# Altium project Health Bracelet.PrjPcb
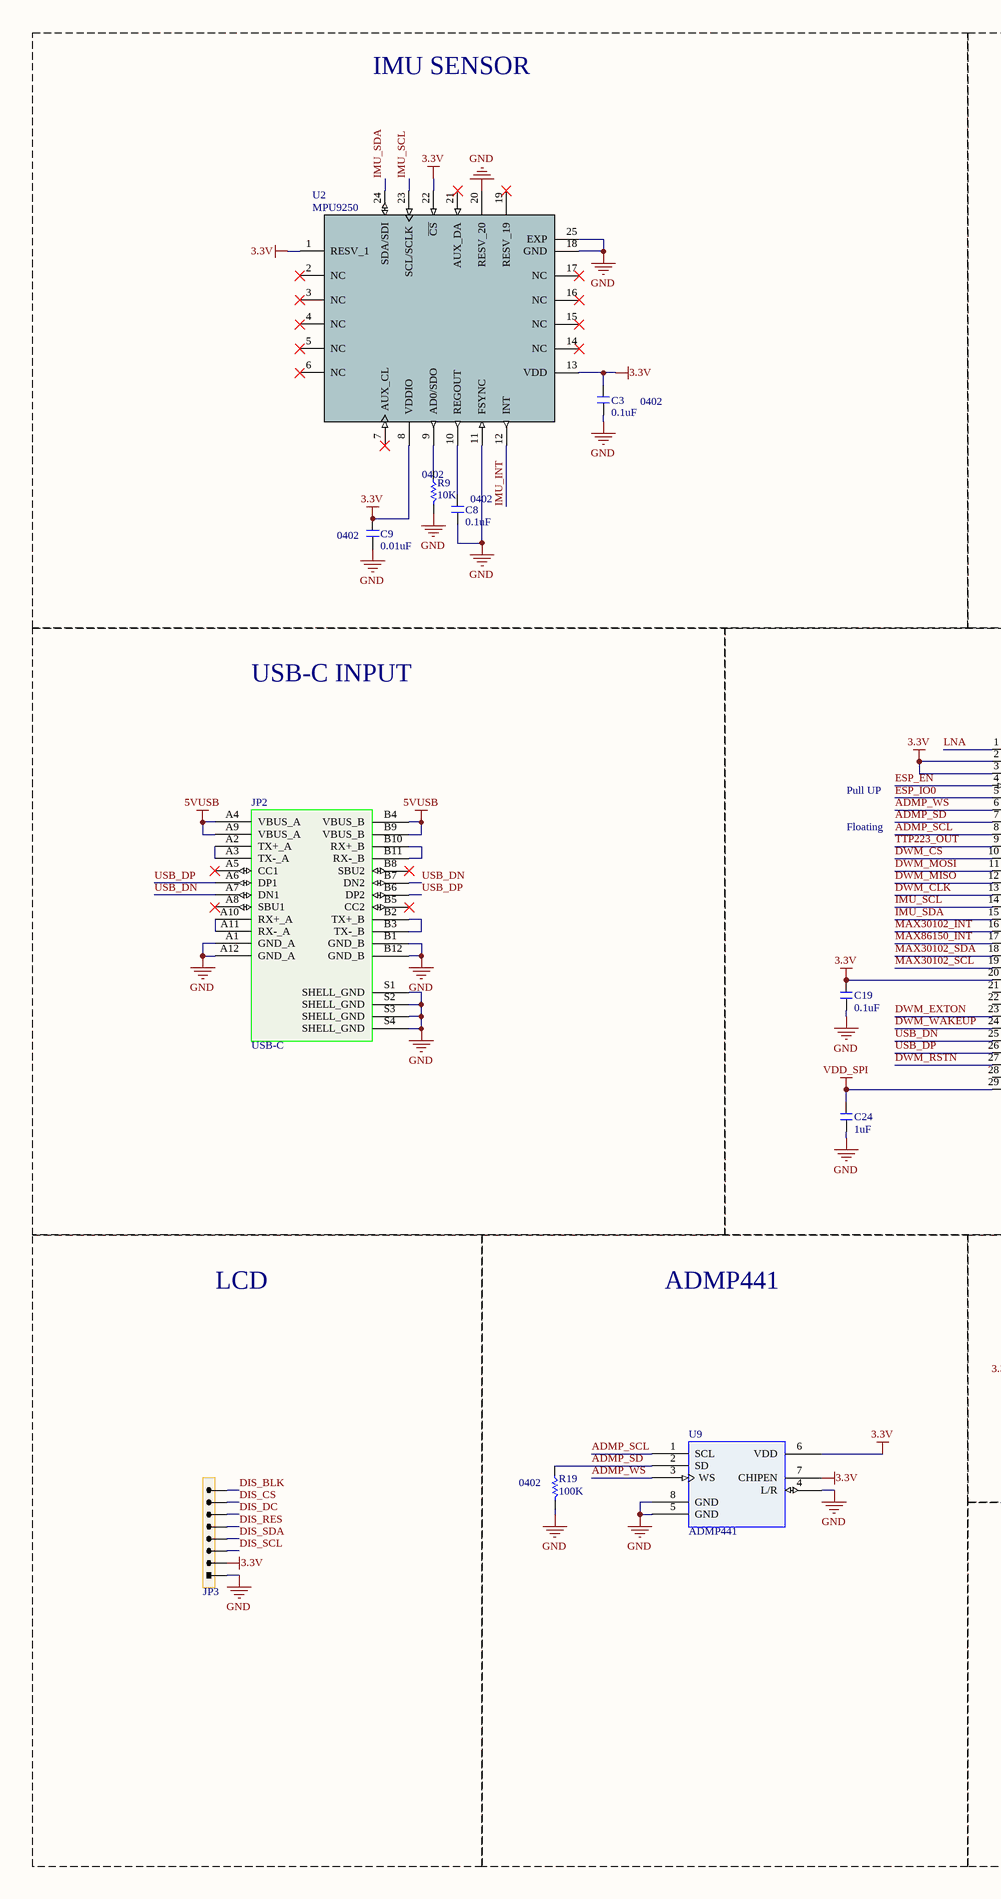
[diagram p0: Main.SchDoc, left]
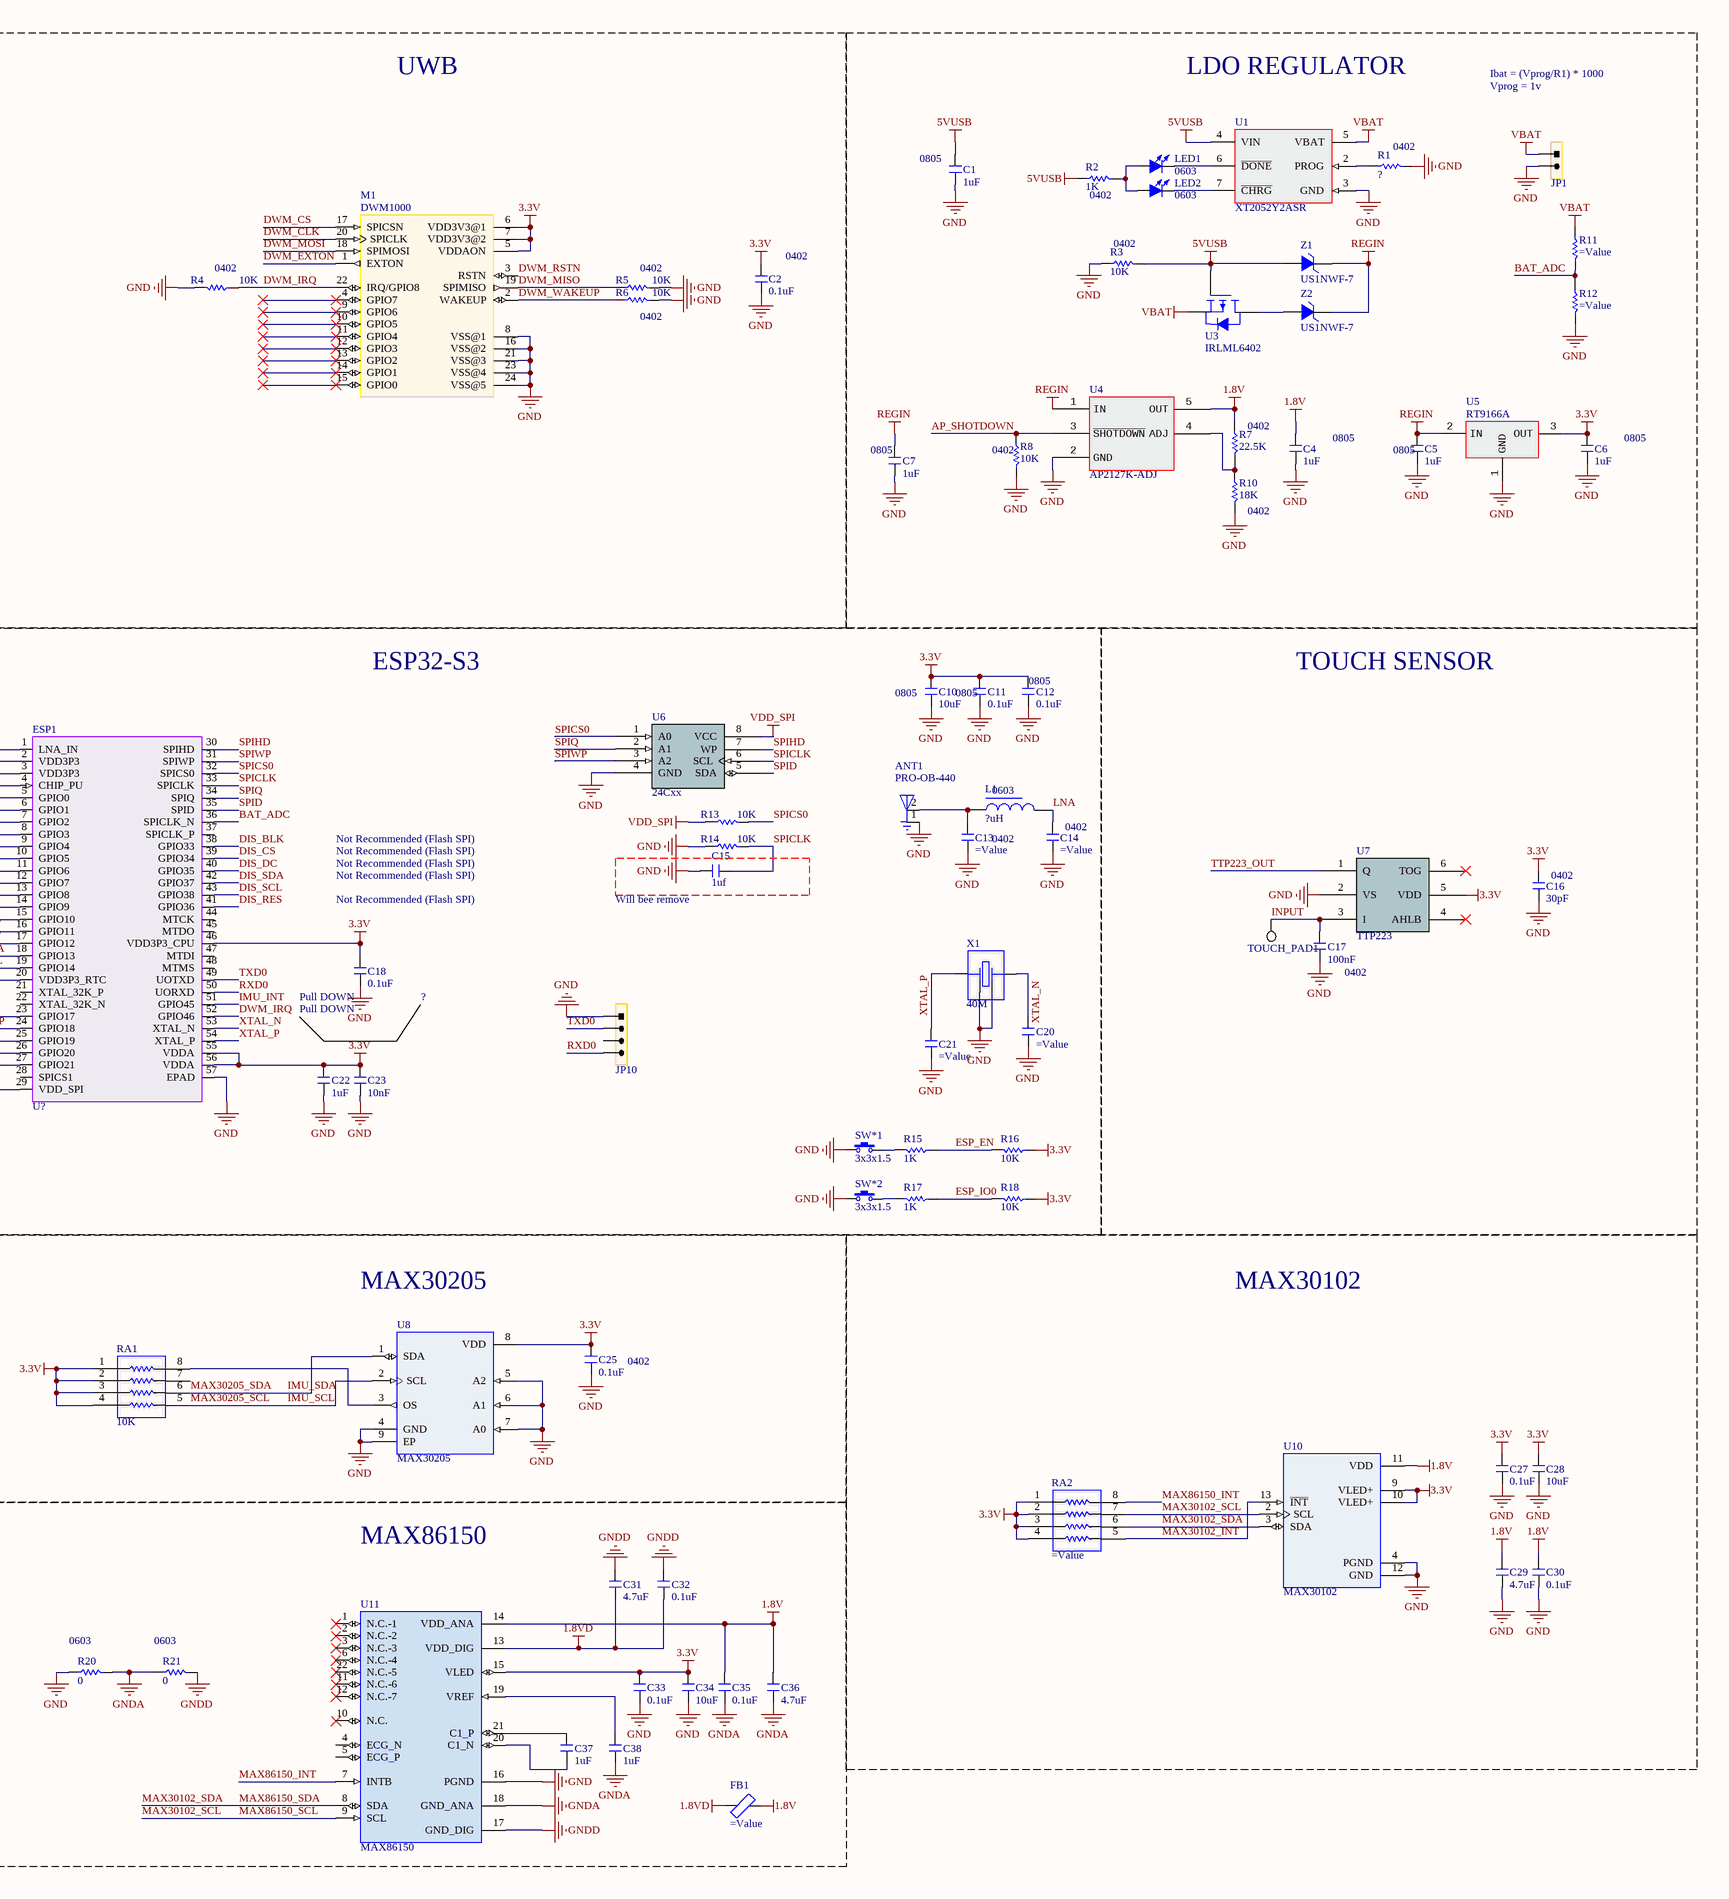
[diagram p1: Main.SchDoc, right]
1 sheet, 88 parts. Net scope: global (net labels, ports and power ports of the same name join across sheets).
Board file: Health Bracelet PCB.PcbDoc

## Sheet Main.SchDoc
size A2; Date: 4/5/2023; Author: AmirHosein Yousefi; SheetNumber: 1; SheetTotal: 1; Time: 12:05

### Parts
ANT1  PRO-OB-440  [PRO-OB-440]
C1  1uF  [C 0805]
C2  0.1uF  [C 0402]
C3  0.1uF  [C 0603]
C4  1uF  [C 0805]
C5  1uF  [C 0805]
C6  1uF  [C 0805]
C7  1uF  [C 0805]
C8  0.1uF  [C 0603]
C9  0.01uF  [C 0603]
C10  10uF  [C 0603]
C11  0.1uF  [C 0603]
C12  0.1uF  [C 0603]
C13  (no value)  [C 0402]
C14  (no value)  [C 0402]
C15  1uf  [C 0402]
C16  30pF  [C 0402]
C17  100nF  [C 0402]
C18  0.1uF  [C 0603]
C19  0.1uF  [C 0603]
C20  (no value)  [C 0402]
C21  (no value)  [C 0402]
C22  1uF  [C 0603]
C23  10nF  [C 0603]
C24  1uF  [C 0603]
C25  0.1uF  [C 0603]
C27  0.1uF  [C 0603]
C28  10uF  [C 0603]
C29  4.7uF  [C 0603]
C30  0.1uF  [C 0603]
C31  4.7uF  [C 0603]
C32  0.1uF  [C 0603]
C33  0.1uF  [C 0603]
C34  10uF  [C 0603]
C35  0.1uF  [C 0603]
C36  4.7uF  [C 0603]
C37  1uF  [C 0603]
C38  1uF  [C 0603]
ESP1  U?  [ESP32-S3 CHIP]
FB1  (no value)  [F 0603]
JP1  HDR-1X2  [PH2.0-2P_H]  (value not drawn)
JP2  USB-C  [USB-C-RIGHT]
JP3  HDR-1X8  [HDR-1X8_M]  (value not drawn)
JP10  HDR-1X4  [HDR-4X1-SMD]  (value not drawn)
L1  ?uH  [L 0603]
LED1  LED-SMD  [LED 0603R]  (value not drawn)
LED2  LED-SMD  [LED 0603G]  (value not drawn)
M1  DWM1000  [DWM1000]
R1  ?  [R 0402]
R2  1K  [R 0603]
R3  10K  [R 0402]
R4  10K  [R 0402]
R5  10K  [R 0402]
R6  10K  [R 0402]
R7  22.5K  [R 0402]
R8  10K  [R 0402]
R9  10K  [R 0603]
R10  18K  [R 0402]
R11  (no value)  [R 0402]
R12  (no value)  [R 0402]
R13  10K  [R 0402]
R14  10K  [R 0402]
R15  1K  [R 0603-HP]
R16  10K  [R 0603-HP]
R17  1K  [R 0603-HP]
R18  10K  [R 0603-HP]
R19  100K  [R 0402]
R20  0  [R 0603]
R21  0  [R 0603]
RA1  10K  [RA1206 (4x0603)]
RA2  (no value)  [RA1206 (4x0603)]
SW*1  3x3x1.5  [TSW SMD-3*3]
SW*2  3x3x1.5  [TSW SMD-3*3]
TOUCH_PAD1  Test Point Pad  [TP07SQ]  (value not drawn)
U1  XT2052Y2ASR  [SOP8_M-EP]
U2  MPU9250  [QFN40-25N]
U3  IRLML6402  [SOT23-3L]
U4  AP2127K-ADJ  [SOT23-5L]
U5  RT9166A  [SOT89_M]
U6  24Cxx  [SOP8_L]
U7  TTP223  [SOT23-6L]
U8  MAX30205  [MAX30205]
U9  ADMP441  [ADMP441]
U10  MAX30102  [MAX30102]
U11  MAX86150  [MAX86150]
X1  40M  [XTAL-3225-4]
Z1  US1NWF-7  [DO-213AA]
Z2  US1NWF-7  [DO-213AA]

### Nets
1.8V: C4.1 C29.1 C30.1 C35.1 C36.1 FB1.2 R7.1 U4.5(OUT) U10.11(VDD) U11.14(VDD_ANA)
1.8VD: C31.2 C32.2 FB1.1 U11.13(VDD_DIG)
3.3V: C2.2 C3.1 C6.1 C9.1 C10.1 C11.1 C12.1 C16.1 C18.1 C19.1 C22.1 C23.1 C25.1 C27.1 C28.1 C33.1 C34.1 ESP1.2(VDD3P3) ESP1.3(VDD3P3) ESP1.20(VDD3P3_RTC) ESP1.46(VDD3P3_CPU) ESP1.55(VDDA) ESP1.56(VDDA) JP3.2 M1.5(VDDAON) M1.6(VDD3V3@1) M1.7(VDD3V3@2) R16.1 R18.1 RA1.1 RA1.2 RA1.3 RA1.4 RA2.1 RA2.2 RA2.3 RA2.4 U2.1(RESV_1) U2.8(VDDIO) U2.13(VDD) U2.22(~{CS}) U5.3(OUT) U7.5(VDD) U8.8(VDD) U9.6(VDD) U9.7(CHIPEN) U10.9(VLED+) U10.10(VLED+) U11.15(VLED)
5VUSB: C1.1 JP2.A4(VBUS_A) JP2.A9(VBUS_A) JP2.B4(VBUS_B) JP2.B9(VBUS_B) R2.1 R3.2 U1.4(VIN) U3.1(G) Z1.1(A)
GND: ANT1.1(GND) C1.2 C2.1 C3.2 C4.2 C5.2 C6.2 C7.2 C8.2 C9.2 C10.2 C11.2 C12.2 C13.2 C14.2 C15.1 C16.2 C17.2 C18.2 C19.2 C20.2 C21.2 C22.2 C23.2 C24.2 C25.2 C27.2 C28.2 C29.2 C30.2 C33.2 C34.2 ESP1.57(EPAD) JP1.2 JP2.A1(GND_A) JP2.A12(GND_A) JP2.B1(GND_B) JP2.B12(GND_B) JP2.S1(SHELL_GND) JP2.S2(SHELL_GND) JP2.S3(SHELL_GND) JP2.S4(SHELL_GND) JP3.1 JP10.1 M1.8(VSS@1) M1.16(VSS@2) M1.21(VSS@3) M1.23(VSS@4) M1.24(VSS@5) R1.2 R3.1 R4.2 R5.2 R6.2 R8.2 R9.2 R10.2 R12.2 R14.1 R19.2 R20.1 SW*1.1 SW*2.1 U1.3(GND) U2.11(FSYNC) U2.18(GND) U2.20(RESV_20) U2.25(EXP) U4.2(GND) U5.1(GND) U6.4(GND) U7.2(VS) U8.4(GND) U8.5(A2) U8.6(A1) U8.7(A0) U8.9(EP) U9.4(L/R) U9.5(GND) U9.8(GND) U10.4(PGND) U10.12(GND) U11.16(PGND) X1.2 X1.4
GNDA: C35.2 C36.2 C38.2 R20.2 R21.1 U11.18(GND_ANA)
GNDD: C31.1 C32.1 R21.2 U11.17(GND_DIG)
REGIN: C5.1 C7.1 U4.1(IN) U5.2(IN) Z1.2(K) Z2.2(K)
VBAT: JP1.1 R11.1 U1.5(VBAT) U3.2(S)
VDD_SPI: C24.1 ESP1.29(VDD_SPI) R13.1 U6.8(VCC)
ADMP_SCL: ESP1.8(GPIO3) U9.1(SCL)
ADMP_SD: ESP1.7(GPIO2) R19.1 U9.2(SD)
ADMP_WS: ESP1.6(GPIO1) U9.3(WS)
AP_SHOTDOWN: R8.1 U4.3(~{SHOTDOWN})
BAT_ADC: ESP1.36(SPICLK_N) R11.2 R12.1
DIS_BLK: ESP1.38(GPIO33) JP3.8
DIS_CS: ESP1.39(GPIO34) JP3.7
DIS_DC: ESP1.40(GPIO35) JP3.6
DIS_RES: ESP1.41(GPIO36) JP3.5
DIS_SCL: ESP1.43(GPIO38) JP3.3
DIS_SDA: ESP1.42(GPIO37) JP3.4
DWM_CLK: ESP1.13(GPIO8) M1.20(SPICLK)
DWM_CS: ESP1.10(GPIO5) M1.17(SPICSN)
DWM_EXTON: ESP1.23(GPIO17) M1.1(EXTON)
DWM_IRQ: ESP1.52(GPIO46) M1.22(IRQ/GPIO8) R4.1
DWM_MISO: ESP1.12(GPIO7) M1.19(SPIMISO) R5.1
DWM_MOSI: ESP1.11(GPIO6) M1.18(SPIMOSI)
DWM_RSTN: ESP1.27(GPIO21) M1.3(RSTN)
DWM_WAKEUP: ESP1.24(GPIO18) M1.2(WAKEUP) R6.1
ESP_EN: ESP1.4(CHIP_PU) R15.1 R16.2
ESP_IO0: ESP1.5(GPIO0) R17.1 R18.2
IMU_INT: ESP1.51(GPIO45) U2.12(INT)
IMU_SCL: ESP1.14(GPIO9) RA1.5 U2.23(SCL/SCLK) U8.2(SCL)  [also labelled MAX30205_SCL]
IMU_SDA: ESP1.15(GPIO10) RA1.6 U2.24(SDA/SDI) U8.1(SDA)  [also labelled MAX30205_SDA]
INPUT: C17.1 TOUCH_PAD1.1 U7.3(I)
LNA: C14.1 ESP1.1(LNA_IN) L1.2
MAX30102_INT: ESP1.16(GPIO11) RA2.5 U10.13(~{INT})
MAX30102_SCL: ESP1.19(GPIO14) RA2.7 U10.2(SCL) U11.9(SCL)  [also labelled MAX86150_SCL]
MAX30102_SDA: ESP1.18(GPIO13) RA2.6 U10.3(SDA) U11.8(SDA)  [also labelled MAX86150_SDA]
MAX86150_INT: ESP1.17(GPIO12) RA2.8 U11.7(INTB)
RXD0: ESP1.50(UORXD) JP10.4
SPICLK: C15.2 ESP1.33(SPICLK) R14.2 U6.6(SCL)
SPICS0: ESP1.32(SPICS0) R13.2 U6.1(A0)
SPID: ESP1.35(SPID) U6.5(SDA)
SPIHD: ESP1.30(SPIHD) U6.7(WP)
SPIQ: ESP1.34(SPIQ) U6.2(A1)
SPIWP: ESP1.31(SPIWP) U6.3(A2)
TTP223_OUT: ESP1.9(GPIO4) U7.1(Q)
TXD0: ESP1.49(UOTXD) JP10.2
USB_DN: ESP1.25(GPIO19) JP2.A7(DN1) JP2.B7(DN2)
USB_DP: ESP1.26(GPIO20) JP2.A6(DP1) JP2.B6(DP2)
XTAL_N: C20.1 ESP1.53(XTAL_N) X1.3
XTAL_P: C21.1 ESP1.54(XTAL_P) X1.1
NetANT1_2: ANT1.2(FEED) C13.1 L1.1
NetC8_1: C8.1 U2.10(REGOUT)
NetC37_1: C37.1 U11.21(C1_P)
NetC37_2: C37.2 U11.20(C1_N)
NetC38_1: C38.1 U11.19(VREF)
NetJP2_A2: JP2.A2(TX+_A) JP2.A3(TX-_A)
NetJP2_A10: JP2.A10(RX+_A) JP2.A11(RX-_A)
NetJP2_B2: JP2.B2(TX+_B) JP2.B3(TX-_B)
NetJP2_B10: JP2.B10(RX+_B) JP2.B11(RX-_B)
NetLED1_1: LED1.1(A) LED2.1(A) R2.2
NetLED1_2: LED1.2(K) U1.6(~{DONE})
NetLED2_2: LED2.2(K) U1.7(~{CHRG})
NetR1_1: R1.1 U1.2(PROG)
NetR7_2: R7.2 R10.1 U4.4(ADJ)
NetR9_1: R9.1 U2.9(AD0/SDO)
NetR15_2: R15.2 SW*1.2
NetR17_2: R17.2 SW*2.2
NetRA1_8: RA1.8 U8.3(OS)
NetU3_3: U3.3(D) Z2.1(A)

Not connected (* = marked no-connect by the designer): ESP1 21(XTAL_32K_P) 22(XTAL_32K_N) 28(SPICS1) 37(SPICLK_P) 44(MTCK) 45(MTDO) 47(MTDI) 48(MTMS); JP2 A5(CC1)* A8(SBU1)* B5(CC2)* B8(SBU2)*; JP10 3; M1 4(GPIO7)* 9(GPIO6)* 10(GPIO5)* 11(GPIO4)* 12(GPIO3)* 13(GPIO2)* 14(GPIO1)* 15(GPIO0)*; RA1 7; U2 2(NC)* 3(NC)* 4(NC)* 5(NC)* 6(NC)* 7(AUX_CL)* 14(NC)* 15(NC)* 16(NC)* 17(NC)* 19(RESV_19)* 21(AUX_DA)*; U7 4(AHLB)* 6(TOG)*; U11 1(N.C.-1)* 2(N.C.-2)* 3(N.C.-3)* 4(ECG_N) 5(ECG_P) 6(N.C.-4)* 10(N.C.)* 11(N.C.-6)* 12(N.C.-7)* 22(N.C.-5)*

### Notes on the sheet
- IMU SENSOR
- UWB
- LDO REGULATOR
- Ibat = (Vprog/R1) * 1000
- Vprog = 1v
- (near C1) 0805
- (near R1) 0402
- (near R2) 0402
- (near LED2) 0603
- 0603
- (near R4) 0402
- (near R5) 0402
- (near C2) 0402
- (near R3) 0402
- (near R6) 0402
- (near C3) 0402
- (near C7) 0805
- (near R8) 0402
- (near R7) 0402
- (near C4) 0805
- (near C5) 0805
- (near C6) 0805
- (near R9) 0402
- (near C8) 0402
- (near R10) 0402
- (near C9) 0402
- USB-C INPUT
- ESP32-S3
- (near C10) 0805
- (near C11) 0805
- (near C12) 0805
- TOUCH SENSOR
- Pull UP
- Floating
- (near L1) 0603
- (near C14) 0402
- Not Recommended (Flash SPI)
- 0402
- (near C16) 0402
- (near C15) Will bee remove
- (near C18) Pull DOWN
- ?
- LCD
- ADMP441
- MAX30205
- MAX30102
- (near C25) 0402
- (near R19) 0402
- MAX86150
- (near R20) 0603
- (near R21) 0603

### Library data of the parts
C1-C25 C27-C38 = C: Non-polar patch capacitor; BOM名称: 无极性贴片电容; 版权归属: 源创客; 学习资源: www.ooocke.com
ESP1 = ESP32-S3 CHIP
FB1 = FB: Ferrite Bead; BOM名称: 贴片电阻; 版权归属: 源创客; 学习资源: www.ooocke.com
JP1 = Header 2: 2P Connector; BOM名称: 2P接插件; 版权归属: 源创客; 学习资源: www.ooocke.com
JP2 = USB-C-RIGHT
JP3 = Header 8: 8P Connector; BOM名称: 8P接插件; 版权归属: 源创客; 学习资源: www.ooocke.com
JP10 = Header 4: 4P Connector; BOM名称: 4P接插件; 版权归属: 源创客; 学习资源: www.ooocke.com
L1 = L: Low power chip inductor; BOM名称: 小功率贴片电感; 版权归属: 源创客; 学习资源: www.ooocke.com
LED1 LED2 = LED-SMD: Patch LED; BOM名称: 贴片LED; 版权归属: 源创客; 学习资源: www.ooocke.com
R1-R21 = R: Chip resistor; 版权归属: 源创客; BOM名称: Chip resistor; 学习资源: www.ooocke.com
RA1 RA2 = R-ARR: 4 way Chip Resistor Array
SW*1 SW*2 = TSW 3x3: 3x3 tact switch
TOUCH_PAD1 = Test Point Pad: Company: SJ Libraries; Designer: Eng. Saeid Jorablo; Mounting Technology: Surface Mount\Through-Hole; ComponentLink1Description: Datasheet; Pin Count: 0; Update Date: 6/3/2012; Category: MISC; HelpURL: http://s3.picofile.com/file/7443264187/Coming_Soon_logo.gif
U3 = IRLML6402: P-Channel
U5 = RT9166A-33GXL
U6 = 24Cxx: Two-wire Serial EEPROM; BOM名称: 外置EEPROM; 版权归属: 源创客; 学习资源: www.ooocke.com
U8 = MAX30205: Body Temprature
U11 = MAX86150EFF+
X1 = XTAL-4: 4-Pin crystal; BOM名称: 4脚晶振; 版权归属: 源创客; 学习资源: www.ooocke.com
Z1 Z2 = 1N4106: 12V/0.5W voltage regulator; BOM名称: 12V/0.5W稳压管; 版权归属: 源创客; 学习资源: www.ooocke.com